# EAGLE design jiffy-neoram-smd (EAGLE 7.0.0)
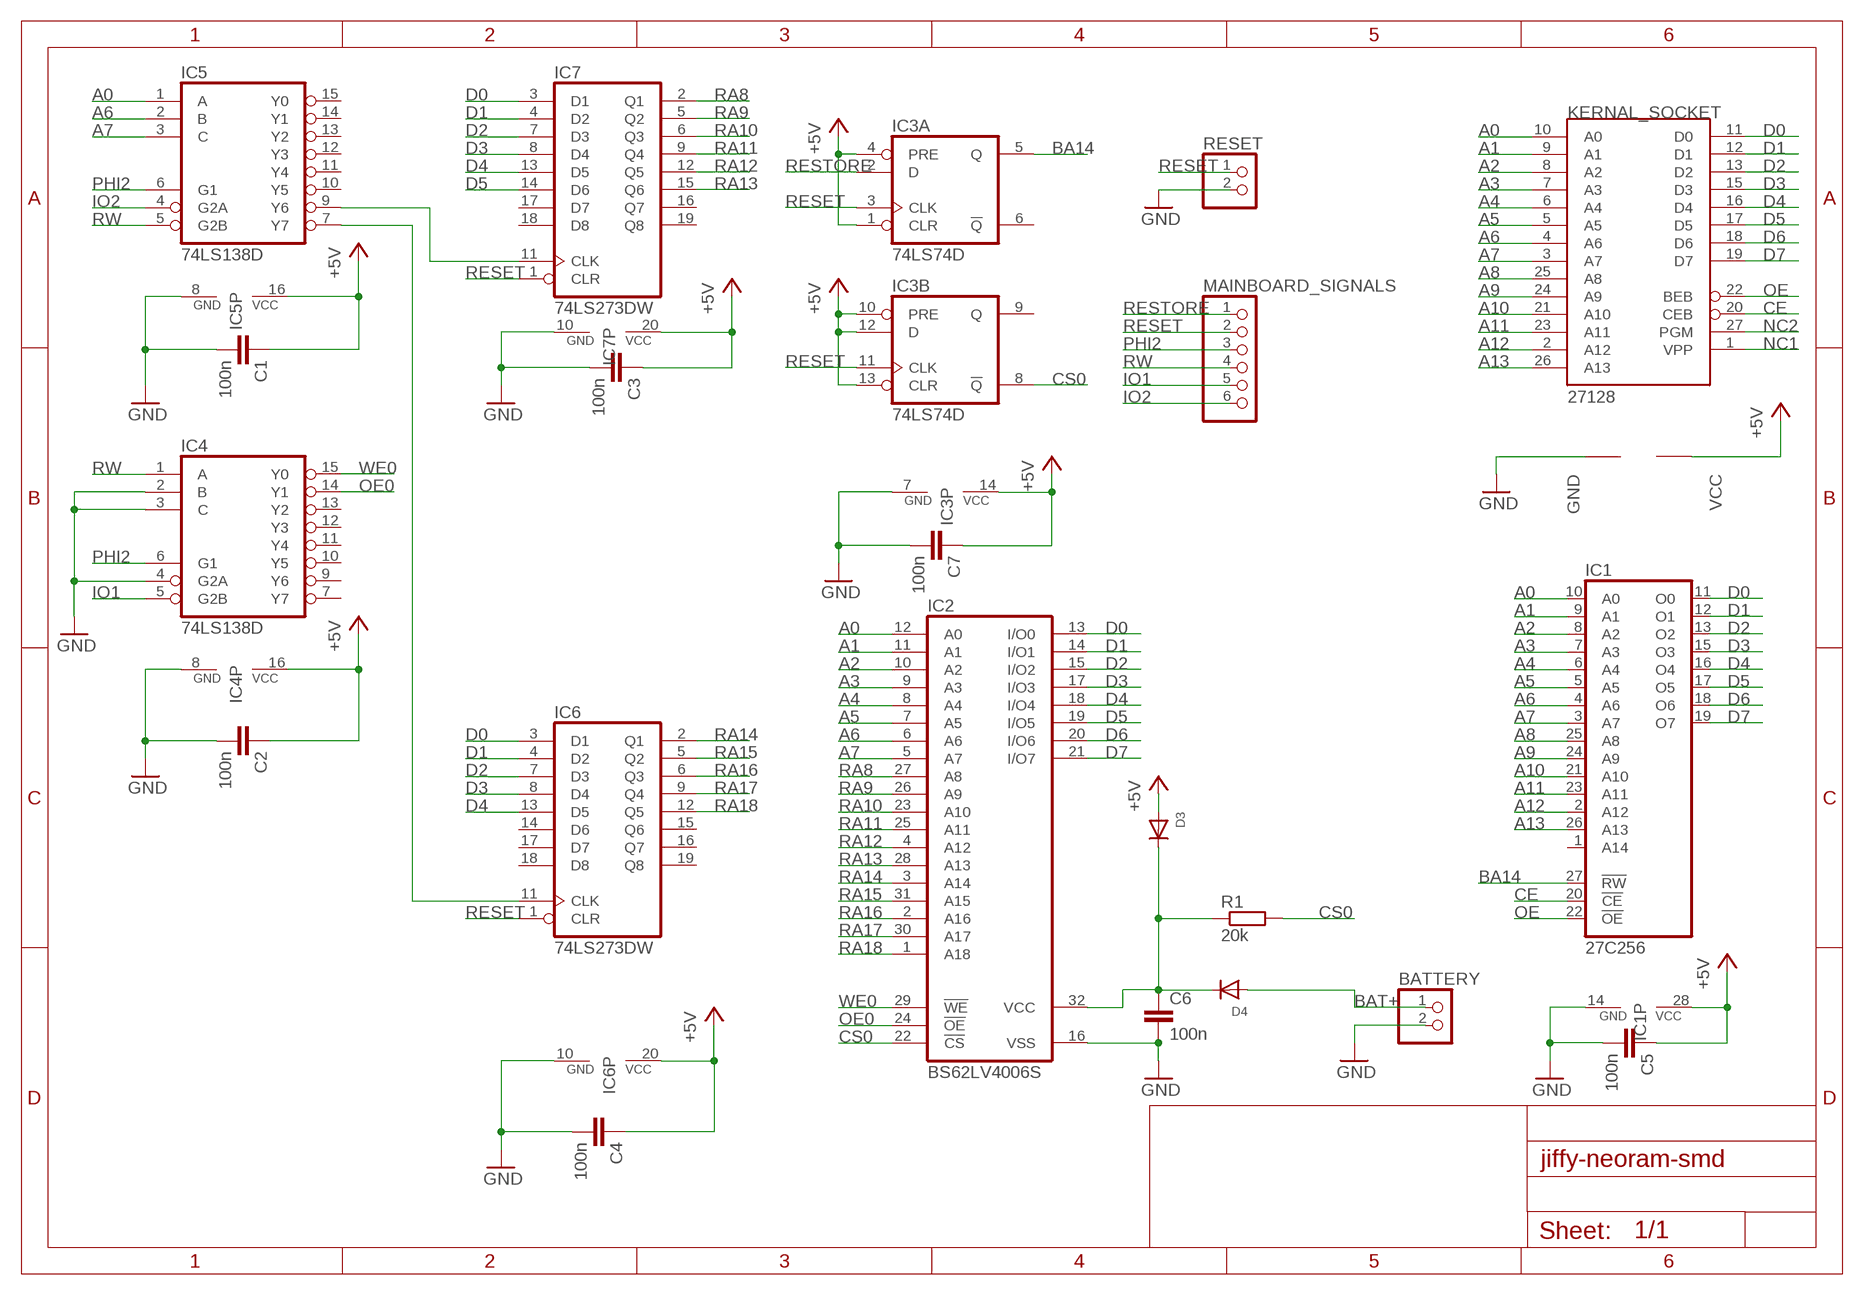
[diagram p0: schematic, sheet 1]

## Parts
BATTERY  HEADER-1X2ROUND  [1X02_ROUND]
C1  100n  C-EUC0603  [C0603]
C2  100n  C-EUC0603  [C0603]
C3  100n  C-EUC0603  [C0603]
C4  100n  C-EUC0603  [C0603]
C5  100n  C-EUC0603  [C0603]
C6  100n  C-EUC0603  [C0603]
C7  100n  C-EUC0603  [C0603]
D3  DIODESOD-323F  [SOD-323F]
D4  DIODESOD-323F  [SOD-323F]
IC1  27C256  TC55257DP  [DIL28]
IC2  BS62LV4006S  [SOP-32]
IC3  74LS74D  [SO14]
IC4  74LS138D  [SO16]
IC5  74LS138D  [SO16]
IC6  74LS273DW  [SO20W]
IC7  74LS273DW  [SO20W]
KERNAL_SOCKET  OSROM  [DIL28-6]
MAINBOARD_SIGNALS  HEADER-1X6ROUND  [1X06_ROUND]
R1  20k  R-EU_R0603  [R0603]
RESET  HEADER-1X2ROUND  [1X02_ROUND]

## Nets
+5V: C1.1 C2.1 C3.1 C4.1 C5.1 C7.1 D3.A IC1.28(VCC) IC3.1(A:CLR) IC3.4(A:PRE) IC3.10(B:PRE) IC3.12(B:D) IC3.13(B:CLR) IC3.14(P:VCC) IC4.16(VCC) IC5.16(VCC) IC6.20(VCC) IC7.20(VCC) KERNAL_SOCKET.28(VCC)
A0: IC1.10(A0) IC2.12(A0) IC5.1(A) KERNAL_SOCKET.10(A0)
A1: IC1.9(A1) IC2.11(A1) KERNAL_SOCKET.9(A1)
A2: IC1.8(A2) IC2.10(A2) KERNAL_SOCKET.8(A2)
A3: IC1.7(A3) IC2.9(A3) KERNAL_SOCKET.7(A3)
A4: IC1.6(A4) IC2.8(A4) KERNAL_SOCKET.6(A4)
A5: IC1.5(A5) IC2.7(A5) KERNAL_SOCKET.5(A5)
A6: IC1.4(A6) IC2.6(A6) IC5.2(B) KERNAL_SOCKET.4(A6)
A7: IC1.3(A7) IC2.5(A7) IC5.3(C) KERNAL_SOCKET.3(A7)
A8: IC1.25(A8) KERNAL_SOCKET.25(A8)
A9: IC1.24(A9) KERNAL_SOCKET.24(A9)
A10: IC1.21(A10) KERNAL_SOCKET.21(A10)
A11: IC1.23(A11) KERNAL_SOCKET.23(A11)
A12: IC1.2(A12) KERNAL_SOCKET.2(A12)
A13: IC1.26(A13) KERNAL_SOCKET.26(A13)
BA14: IC1.27(!RW) IC3.5(A:Q)
BAT+: BATTERY.1 D4.A
CE: IC1.20(!CE) KERNAL_SOCKET.20(CEB)
CS0: IC2.22(!CS) IC3.8(B:!Q) R1.2
D0: IC1.11(O0) IC2.13(I/O0) IC6.3(D1) IC7.3(D1) KERNAL_SOCKET.11(D0)
D1: IC1.12(O1) IC2.14(I/O1) IC6.4(D2) IC7.4(D2) KERNAL_SOCKET.12(D1)
D2: IC1.13(O2) IC2.15(I/O2) IC6.7(D3) IC7.7(D3) KERNAL_SOCKET.13(D2)
D3: IC1.15(O3) IC2.17(I/O3) IC6.8(D4) IC7.8(D4) KERNAL_SOCKET.15(D3)
D4: IC1.16(O4) IC2.18(I/O4) IC6.13(D5) IC7.13(D5) KERNAL_SOCKET.16(D4)
D5: IC1.17(O5) IC2.19(I/O5) IC7.14(D6) KERNAL_SOCKET.17(D5)
D6: IC1.18(O6) IC2.20(I/O6) KERNAL_SOCKET.18(D6)
D7: IC1.19(O7) IC2.21(I/O7) KERNAL_SOCKET.19(D7)
GND: BATTERY.2 C1.2 C2.2 C3.2 C4.2 C5.2 C6.2 C7.2 IC1.14(GND) IC2.16(VSS) IC3.7(P:GND) IC4.2(B) IC4.3(C) IC4.4(G2A) IC4.8(GND) IC5.8(GND) IC6.10(GND) IC7.10(GND) KERNAL_SOCKET.14(GND) RESET.2
IO1: IC4.5(G2B) MAINBOARD_SIGNALS.5
IO2: IC5.4(G2A) MAINBOARD_SIGNALS.6
N$1: IC5.9(Y6) IC7.11(CLK)
N$2: IC5.7(Y7) IC6.11(CLK)
N$3: C6.1 D3.C D4.C IC2.32(VCC) R1.1
NC1: KERNAL_SOCKET.1(VPP)
NC2: KERNAL_SOCKET.27(PGM)
OE: IC1.22(!OE) KERNAL_SOCKET.22(BEB)
OE0: IC2.24(!OE) IC4.14(Y1)
PHI2: IC4.6(G1) IC5.6(G1) MAINBOARD_SIGNALS.3
RA8: IC2.27(A8) IC7.2(Q1)
RA9: IC2.26(A9) IC7.5(Q2)
RA10: IC2.23(A10) IC7.6(Q3)
RA11: IC2.25(A11) IC7.9(Q4)
RA12: IC2.4(A12) IC7.12(Q5)
RA13: IC2.28(A13) IC7.15(Q6)
RA14: IC2.3(A14) IC6.2(Q1)
RA15: IC2.31(A15) IC6.5(Q2)
RA16: IC2.2(A16) IC6.6(Q3)
RA17: IC2.30(A17) IC6.9(Q4)
RA18: IC2.1(A18) IC6.12(Q5)
RESET: IC3.3(A:CLK) IC3.11(B:CLK) IC6.1(CLR) IC7.1(CLR) MAINBOARD_SIGNALS.2 RESET.1
RESTORE: IC3.2(A:D) MAINBOARD_SIGNALS.1
RW: IC4.1(A) IC5.5(G2B) MAINBOARD_SIGNALS.4
WE0: IC2.29(!WE) IC4.15(Y0)
Unconnected: IC1.1(A14) IC3.6(A:!Q) IC3.9(B:Q) IC4.7(Y7) IC4.9(Y6) IC4.10(Y5) IC4.11(Y4) IC4.12(Y3) IC4.13(Y2) IC5.10(Y5) IC5.11(Y4) IC5.12(Y3) IC5.13(Y2) IC5.14(Y1) IC5.15(Y0) IC6.14(D6) IC6.15(Q6) IC6.16(Q7) IC6.17(D7) IC6.18(D8) IC6.19(Q8) IC7.16(Q7) IC7.17(D7) IC7.18(D8) IC7.19(Q8)

## Library data of the parts
BATTERY RESET = microbuilder:HEADER-1X2: PIN HEADER
C1-C7 = resistor:C-EU: CAPACITOR, European symbol
D3 D4 = adafruit:DIODE: Diode SMADIODE - SMA Surface Mount Package 20V 1A Schottky Diode Digikey: 641-1014-6-ND DO-1N4148 - Through Hole Small Current Diode SOD-123 20V 1 A (.5mV Vf) Schottky Diode - Digikey: MBRX120TPMSCT-ND SOD-323 10V 570mA (.38mV Vf, 3ns) Schottky Diode - Digikey: ZLLS410CT-ND SOD-523 30V 30mA Schottky Diode (RB751S-40TE61) - Digikey: RB751S-40TE61CT-ND SOT23-R/W - SOT23 Package (R = Solder Paste/Reflow Ovens, W = Hand-Soldering) BAT54Film 40V 300mA - Digikey: 497-7162-1-ND
IC1 = memory:TC55257DP: MEMORY
IC2 = memory-bsi:BS62LV4006
IC3 = 74xx-eu:74*74: Dual D type positive edge triggered FLIP FLOP, preset and clear
IC4 IC5 = 74xx-eu:74*138: 3-line to 8-line DECODER/DEMULTIPLEXER
IC6 IC7 = 74xx-eu:74*273: Octal D type FLIP FLOP, clear
KERNAL_SOCKET = atari-chips-mod:OSROM
MAINBOARD_SIGNALS = microbuilder:HEADER-1X6: PIN HEADER
R1 = resistor:R-EU_: RESISTOR, European symbol

## Board
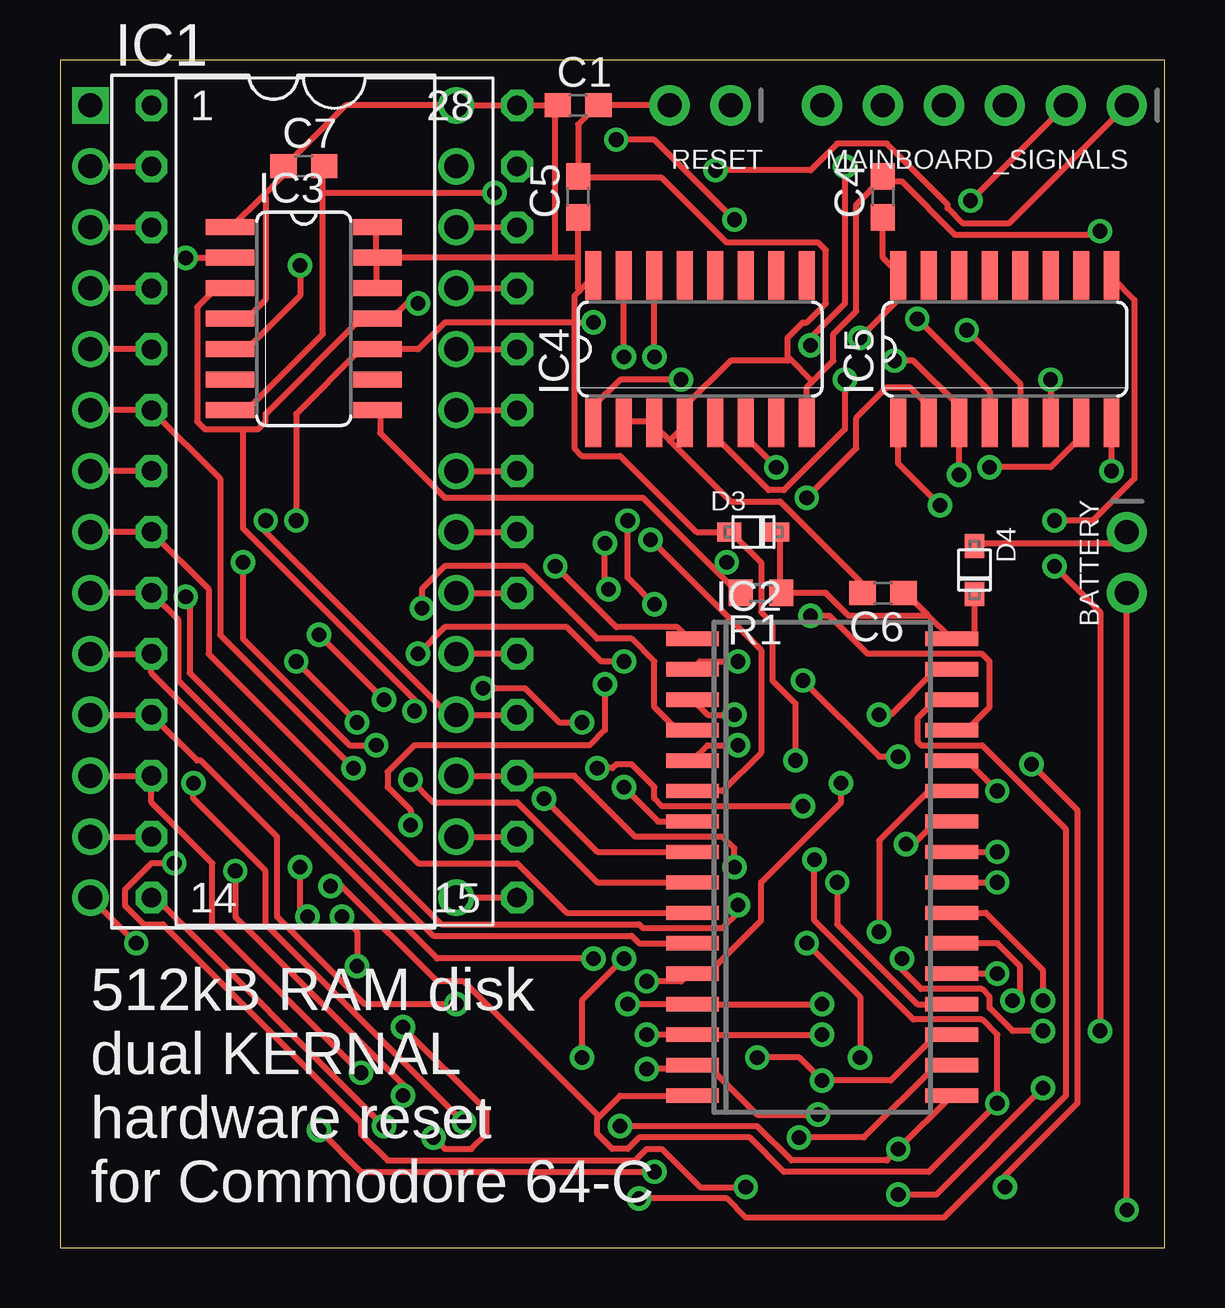
[diagram p1: board, top side]
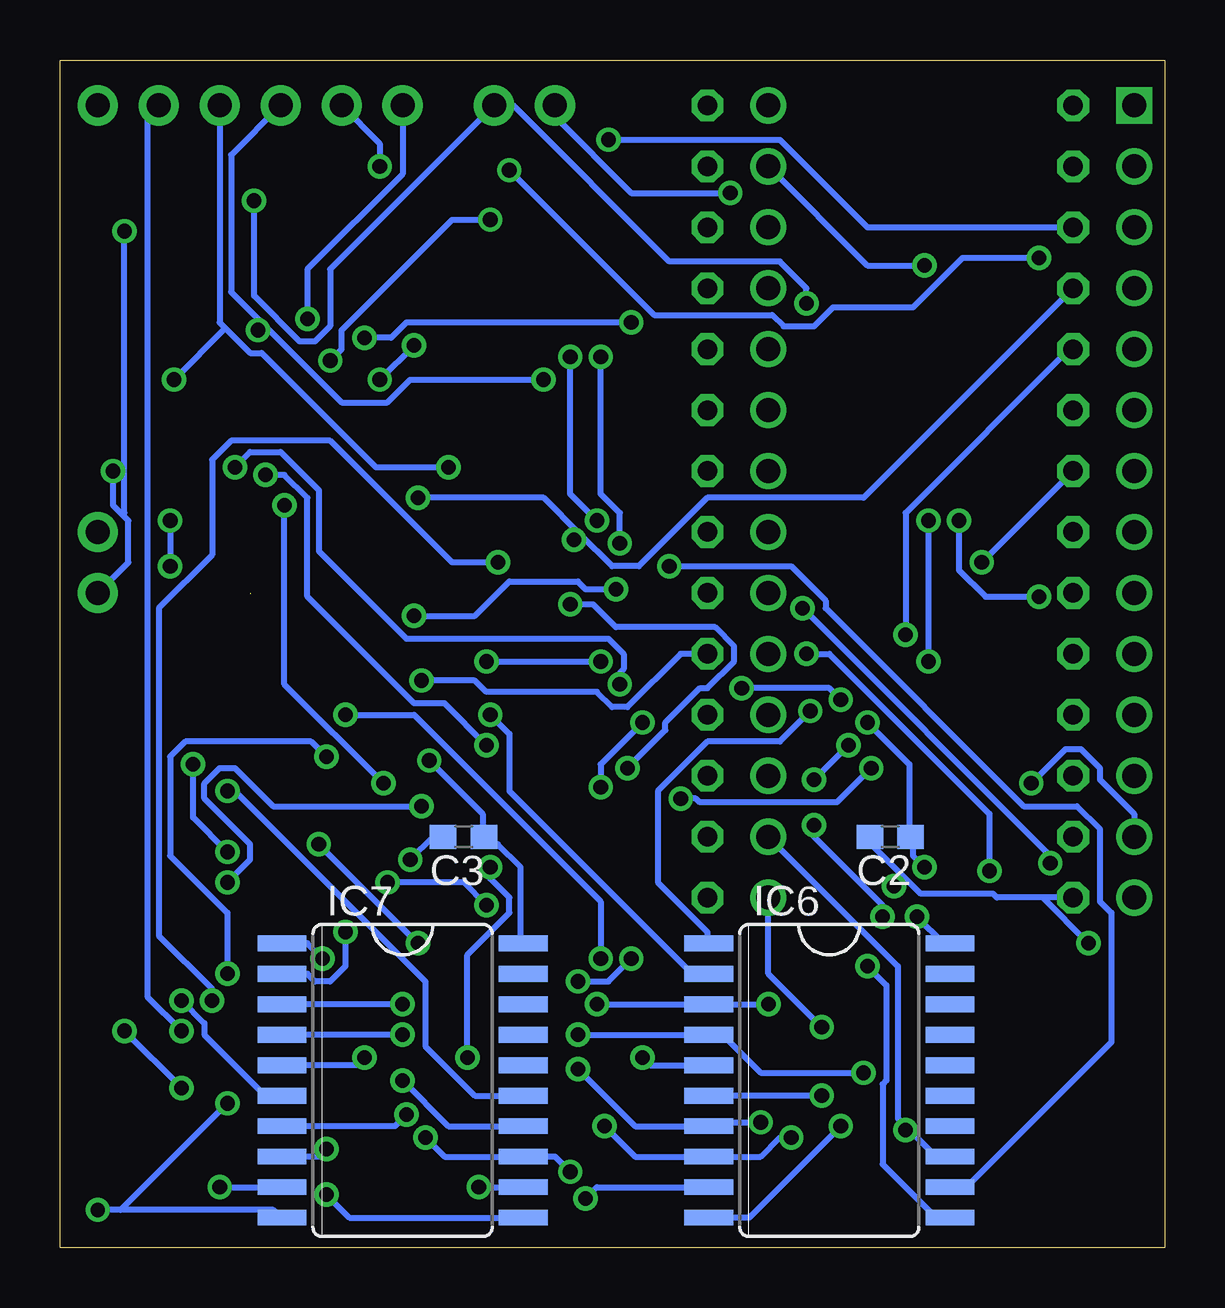
[diagram p2: board, bottom side, seen from below]

Size 46.02 x 49.52 mm. Coordinates in mm from the lower left corner, seen from the top.
Outline: 0,0 46.02,0 46.02,49.52 0,49.52 0,0
Copper layers (1*16): Top 0.035mm / dielectric 1.5mm / Bottom 0.035mm
Design rules "default": minimum track width 10mil, minimum drill 24mil, track to track 8mil, track to pad 8mil, pad to pad 8mil, via to via 8mil, smd to smd 8mil, copper to edge 40mil, drill to drill 8mil, minimum pad ring 10mil, minimum via ring 8mil, stop-mask expansion 4mil, vias tented up to drill 0mil, thermal gap 10mil

### Footprints (pad centres in the part's own frame; a part is rotated, then mirrored left to right if it is on the bottom)
1X02_ROUND = drill 1 pad 1.676: 1 -1.27,0; 2 1.27,0
C0603 = smd 1.1 x 1: 1 -0.85,0; 2 0.85,0
SOD-323F = smd 1 x 0.8: A -1,0; C 1,0
DIL28 = drill 1 square: 1 -16.51,-7.62 | drill 1: 2 -13.97,-7.62; 3 -11.43,-7.62; 4 -8.89,-7.62; 5 -6.35,-7.62; 6 -3.81,-7.62; 7 -1.27,-7.62; 8 1.27,-7.62; 9 3.81,-7.62; 10 6.35,-7.62; 11 8.89,-7.62; 12 11.43,-7.62; 13 13.97,-7.62; 14 16.51,-7.62; 15 16.51,7.62; 16 13.97,7.62; 17 11.43,7.62; 18 8.89,7.62; 19 6.35,7.62; 20 3.81,7.62; 21 1.27,7.62; 22 -1.27,7.62; 23 -3.81,7.62; 24 -6.35,7.62; 25 -8.89,7.62; 26 -11.43,7.62; 27 -13.97,7.62; 28 -16.51,7.62
SOP-32 = smd 0.6 x 2.2: 1 -9.525,-5.4; 2 -8.255,-5.4; 3 -6.985,-5.4; 4 -5.715,-5.4; 5 -4.445,-5.4; 6 -3.175,-5.4; 7 -1.905,-5.4; 8 -0.635,-5.4; 9 0.635,-5.4; 10 1.905,-5.4; 11 3.175,-5.4; 12 4.445,-5.4; 13 5.715,-5.4; 14 6.985,-5.4; 15 8.255,-5.4; 16 9.525,-5.4; 17 9.525,5.4; 18 8.255,5.4; 19 6.985,5.4; 20 5.715,5.4; 21 4.445,5.4; 22 3.175,5.4; 23 1.905,5.4; 24 0.635,5.4; 25 -0.635,5.4; 26 -1.905,5.4; 27 -3.175,5.4; 28 -4.445,5.4; 29 -5.715,5.4; 30 -6.985,5.4; 31 -8.255,5.4; 32 -9.525,5.4
SO14 = smd 0.66 x 2.032: 1 -3.81,-3.073; 2 -2.54,-3.073; 3 -1.27,-3.073; 4 0,-3.073; 5 1.27,-3.073; 6 2.54,-3.073; 7 3.81,-3.073; 8 3.81,3.073; 9 2.54,3.073; 10 1.27,3.073; 11 0,3.073; 12 -1.27,3.073; 13 -2.54,3.073; 14 -3.81,3.073
SO16 = smd 0.66 x 2.032: 1 -4.445,-3.073; 2 -3.175,-3.073; 3 -1.905,-3.073; 4 -0.635,-3.073; 5 0.635,-3.073; 6 1.905,-3.073; 7 3.175,-3.073; 8 4.445,-3.073; 9 4.445,3.073; 10 3.175,3.073; 11 1.905,3.073; 12 0.635,3.073; 13 -0.635,3.073; 14 -1.905,3.073; 15 -3.175,3.073; 16 -4.445,3.073
SO20W = smd 0.66 x 2.032: 1 -5.715,-5.029; 2 -4.445,-5.029; 3 -3.175,-5.029; 4 -1.905,-5.029; 5 -0.635,-5.029; 6 0.635,-5.029; 7 1.905,-5.029; 8 3.175,-5.029; 9 4.445,-5.029; 10 5.715,-5.029; 11 5.715,5.029; 12 4.445,5.029; 13 3.175,5.029; 14 1.905,5.029; 15 0.635,5.029; 16 -0.635,5.029; 17 -1.905,5.029; 18 -3.175,5.029; 19 -4.445,5.029; 20 -5.715,5.029
DIL28-6 = drill 0.813 octagon: 1 -16.51,-7.62; 2 -13.97,-7.62; 3 -11.43,-7.62; 4 -8.89,-7.62; 5 -6.35,-7.62; 6 -3.81,-7.62; 7 -1.27,-7.62; 8 1.27,-7.62; 9 3.81,-7.62; 10 6.35,-7.62; 11 8.89,-7.62; 12 11.43,-7.62; 13 13.97,-7.62; 14 16.51,-7.62; 15 16.51,7.62; 16 13.97,7.62; 17 11.43,7.62; 18 8.89,7.62; 19 6.35,7.62; 20 3.81,7.62; 21 1.27,7.62; 22 -1.27,7.62; 23 -3.81,7.62; 24 -6.35,7.62; 25 -8.89,7.62; 26 -11.43,7.62; 27 -13.97,7.62; 28 -16.51,7.62
1X06_ROUND = drill 1 pad 1.676: 1 -6.35,0; 2 -3.81,0; 3 -1.27,0; 4 1.27,0; 5 3.81,0; 6 6.35,0
R0603 = smd 1 x 1.1: 1 -0.85,0; 2 0.85,0

### Placement (x,y rotation side)
BATTERY  44.45,28.57 270 top
C1  21.59,47.62 0 top
C2  11.43,17.14 180 bottom
C3  29.21,17.14 180 bottom
C4  34.29,43.82 90 top
C5  21.59,43.82 90 top
C6  34.29,27.3 180 top
C7  10.16,45.09 0 top
D3  28.89,29.84 0 top
D4  38.1,28.26 270 top
IC1  8.89,31.12 270 top
IC2  31.75,15.88 270 top
IC3  10.16,38.73 270 top
IC4  26.67,37.46 0 top
IC5  39.37,37.46 0 top
IC6  13.97,6.98 270 bottom
IC7  31.75,6.98 270 bottom
KERNAL_SOCKET  11.43,31.12 270 top
MAINBOARD_SIGNALS  38.1,47.62 180 top
R1  29.21,27.3 180 top
RESET  26.67,47.62 180 top

### Tracks (layer width: path | path; a pad name or v marks a point on that pad's centre or on a via)
+5V  (via drill 0.61)
  Top 0.254: 8.49,43.89 7.14,42.54 IC3.1 | 8.49,43.89 9.21,44.61 9.21,45.09 C7.1 9.37,45.09 11.91,47.62 IC1.28 KERNAL_SOCKET.28 20.64,47.62 | IC3.4 7.78,38.73 8.57,39.53 8.57,43.82 8.49,43.89 | v10,15.88 10,14.13 v10.32,13.81 | 13.18,41.27 13.18,40.01 IC3.12 | 13.18,41.27 13.18,42.54 IC3.14 | 13.18,41.27 IC3.13 20.64,41.27 | C4.1 34.29,41.27 34.92,40.64 IC5.16 34.92,39.53 v33.34,37.94 | 21.43,38.58 21.43,39.69 21.67,39.93 | 21.43,38.58 21.43,33.34 21.75,33.02 23.34,33.02 26.51,29.84 D3.A 27.94,29.84 29.21,28.57 29.21,26.51 29.69,26.03 29.69,23.65 30.64,22.7 v30.64,20.32 | 21.67,39.93 22.23,40.48 IC4.16 | 21.59,41.27 21.59,40.01 21.67,39.93 | 21.59,41.27 C5.1 | 21.43,38.58 16.03,38.58 14.92,37.46 IC3.10 12.54,37.46 9.84,34.77 v9.84,30.32 | 21.43,38.58 v22.23,38.58 | 21.59,41.27 20.64,41.27 | v9.84,24.45 v12.38,21.91 | 20.64,41.27 20.64,47.62 | 20.64,47.62 C1.1
  Bottom 0.254: IC7.20 26.83,12.7 26.83,15.88 27.78,16.83 27.94,16.83 28.26,17.14 C3.1 28.42,17.14 28.42,18.1 v30.64,20.32 | v10,15.88 10.48,16.35 10.48,17.14 C2.1 10.64,17.14 10.64,20.16 v12.38,21.91 | v10.32,13.81 9.21,12.7 IC6.20 | v33.34,37.94 32.23,37.94 31.59,38.58 v22.23,38.58 | v9.84,30.32 v9.84,24.45
A0  (via drill 0.61)
  Top 0.254: IC1.10 KERNAL_SOCKET.10 3.81,23.97 15.72,12.06 v22.23,12.06 | IC5.1 34.92,32.7 v36.67,30.96 | v32.54,19.37 32.54,18.57 29.21,15.24 29.21,13.65 26.99,11.43 IC2.12 26.19,11.43 25.88,11.11 v24.45,11.11
  Bottom 0.254: v36.67,30.96 36.67,23.49 v32.54,19.37 | v22.23,12.06 23.18,11.11 v24.45,11.11
A1
  Top 0.254: IC2.11 24.13,12.7 23.81,13.02 15.56,13.02 4.92,23.65 4.92,26.19 KERNAL_SOCKET.9 IC1.9
A2
  Top 0.254: IC2.10 21.11,13.97 19.05,16.03 14.92,16.03 6.19,24.77 6.19,27.46 KERNAL_SOCKET.8 IC1.8
A3  (via drill 0.61)
  Top 0.254: IC2.9 22.38,15.24 19.05,18.57 15.56,18.57 v14.61,19.53 | v13.18,20.95 12.06,20.95 7.62,25.4 v7.62,28.57 | KERNAL_SOCKET.7 IC1.7
  Bottom 0.254: v13.18,20.95 v14.61,19.53 | KERNAL_SOCKET.7 v7.62,28.57
A4  (via drill 0.61)
  Top 0.254: IC2.8 22.38,16.51 v20.16,18.73 | v12.22,20 6.67,25.56 6.67,32.07 KERNAL_SOCKET.6 IC1.6
  Bottom 0.254: v20.16,18.73 19.53,18.73 19.37,18.57 13.65,18.57 v12.22,20
A5  (via drill 0.61)
  Top 0.254: IC2.7 24.92,17.78 v23.5,19.21 | v21.75,21.91 20.8,21.91 19.37,23.34 v17.62,23.34 | v10.79,25.56 v13.49,22.86 | KERNAL_SOCKET.5 IC1.5
  Bottom 0.254: v23.5,19.21 23.5,20.16 v21.75,21.91 | v17.62,23.34 13.97,23.34 v13.49,22.86 | v10.79,25.56 10.79,30.64 3.97,37.46 KERNAL_SOCKET.5
A6  (via drill 0.61)
  Top 0.254: IC5.2 36.2,35.08 35.4,35.88 34.45,35.88 33.18,34.61 33.18,33.34 v31.11,31.27 | IC2.6 27.62,19.05 29.21,20.64 29.21,24.92 v24.61,29.53 | KERNAL_SOCKET.4 IC1.4
  Bottom 0.254: v31.11,31.27 25.88,31.27 24.37,29.77 | 24.37,29.77 23.02,28.42 21.91,28.42 19.05,31.27 12.54,31.27 KERNAL_SOCKET.4 | 24.37,29.77 v24.61,29.53
A7  (via drill 0.61)
  Top 0.254: IC1.3 KERNAL_SOCKET.3 | v37.47,32.23 IC5.3 37.47,35.08 35.56,36.99 v34.77,36.99 | v28.26,20.95 26.99,20.95 IC2.5 | v23.18,46.2 24.77,46.2 v28.1,42.86
  Bottom 0.254: v37.47,32.23 36.67,32.23 35.72,31.27 35.72,27.15 31.27,22.7 30,22.7 v28.26,20.95 | KERNAL_SOCKET.3 12.38,42.54 16.03,46.2 v23.18,46.2 | v28.1,42.86 29.69,42.86 34.29,38.26 34.29,37.46 v34.77,36.99
A8
  Top 0.254: IC1.25 KERNAL_SOCKET.25
A9
  Top 0.254: IC1.24 KERNAL_SOCKET.24
A10
  Top 0.254: IC1.21 KERNAL_SOCKET.21
A11
  Top 0.254: IC1.23 KERNAL_SOCKET.23
A12
  Top 0.254: IC1.2 KERNAL_SOCKET.2
A13
  Top 0.254: IC1.26 KERNAL_SOCKET.26
BA14  (via drill 0.61)
  Top 0.254: IC3.5 7.78,37.46 10,39.69 v10,40.96
  Bottom 0.254: v10,40.96 12.38,40.96 IC1.27
BAT+
  Top 0.254: BATTERY.1 43.97,29.37 38.1,29.37 D4.A
CE
  Top 0.254: IC1.20 KERNAL_SOCKET.20
CS0  (via drill 0.61)
  Top 0.254: 27.38,28.18 24.29,31.27 16.03,31.27 13.34,33.97 13.34,34.93 IC3.8 | 27.38,28.18 28.26,27.3 R1.2 | IC2.22 39.05,12.7 40.01,11.75 40.01,10.64 v39.69,10.32 | 27.38,28.18 v27.78,28.57
  Bottom 0.254: v39.69,10.32 39.69,10.8 41.91,13.02 41.91,26.67 39.69,28.89 39.69,32.86 38.89,33.66 34.77,33.66 29.69,28.57 v27.78,28.57
D0  (via drill 0.61)
  Top 0.254: IC1.11 KERNAL_SOCKET.11 5.71,20.32 5.87,20.32 9.05,17.14 9.05,13.81 12.7,10.16 v16.51,10.16 | v23.65,10.16 IC2.13 v31.75,10.16
  Bottom 0.254: v23.65,10.16 IC6.3 v16.51,10.16 | v31.75,10.16 IC7.3
D1  (via drill 0.61)
  Top 0.254: IC1.12 KERNAL_SOCKET.12 3.81,18.57 6.35,16.03 6.35,13.49 v12.54,7.3 | v24.45,8.89 IC2.14 v31.75,8.89
  Bottom 0.254: v24.45,8.89 IC6.4 18.41,8.89 16.83,7.3 v12.54,7.3 | v31.75,8.89 IC7.4
D2  (via drill 0.61)
  Top 0.254: IC1.13 KERNAL_SOCKET.13 | v24.45,7.46 26.04,7.46 26.19,7.62 IC2.15 26.99,7.62 29.05,5.56 v31.59,5.56 | v5.56,19.37 5.56,18.73 8.57,15.72 8.57,13.49 v16.83,5.24
  Bottom 0.254: v24.45,7.46 22.07,5.08 IC6.7 18.89,5.08 18.73,5.24 v16.83,5.24 | IC7.7 32.07,5.08 v31.59,5.56 | IC1.13 1.27,18.1 2.7,19.53 2.7,20 3.49,20.8 4.13,20.8 v5.56,19.37
D3  (via drill 0.61)
  Top 0.254: IC1.15 KERNAL_SOCKET.15 | v23.34,5.08 29.05,5.08 30.48,3.65 34.45,3.65 v34.92,4.13 IC2.17 | v14.29,9.21 17.78,5.71 17.78,4.76 17.14,4.13 16.03,4.13 v15.56,4.6
  Bottom 0.254: v23.34,5.08 22.07,3.81 IC6.8 16.83,3.81 16.03,4.6 v15.56,4.6 | IC7.8 35.24,3.81 v34.92,4.13 | IC1.15 16.51,11.43 v14.29,9.21
D4  (via drill 0.61)
  Top 0.254: v30.8,4.6 33.5,4.6 36.51,7.62 IC2.18 | IC1.16 KERNAL_SOCKET.16 | v24.77,3.17 12.54,3.17 v10.79,4.92
  Bottom 0.254: v30.8,4.6 30,3.81 IC7.13 25.4,3.81 v24.77,3.17 | IC6.13 9.53,3.81 10.72,5 | 10.72,5 11.11,5.4 11.11,11.75 IC1.16 | v10.79,4.92 10.72,5
D5  (via drill 0.61)
  Top 0.254: IC1.17 KERNAL_SOCKET.17 21.43,19.69 23.97,17.14 27.62,17.14 28.1,16.67 v28.1,15.88 | IC2.19 36.51,8.89 34.61,6.98 v31.75,6.98 30.8,7.94 v29.05,7.94
  Bottom 0.254: IC7.14 29.84,5.08 v31.75,6.98 | v28.1,15.88 28.1,15.4 27.3,14.6 27.3,13.97 29.05,12.22 v29.05,7.94
D6  (via drill 0.61)
  Top 0.254: IC2.20 35.72,10.16 32.38,13.49 v32.38,15.24 | v28.26,14.29 28.26,13.97 27.62,13.34 24.29,13.34 24.13,13.49 15.88,13.49 5.4,23.97 5.4,26.99 v5.24,27.15 | v8.57,30.32 8.57,29.84 16.19,22.23 IC1.18 KERNAL_SOCKET.18
  Bottom 0.254: v32.38,15.24 29.21,15.24 v28.26,14.29 | v5.24,27.15 7.46,27.15 8.57,28.26 v8.57,30.32
D7  (via drill 0.61)
  Top 0.254: v39.05,11.43 IC2.21 | v34.92,20.48 34.13,20.48 v30.96,23.65 | KERNAL_SOCKET.19 IC1.19
  Bottom 0.254: v39.05,11.43 39.05,13.97 41.43,16.35 41.43,20.48 40.8,21.11 35.56,21.11 v34.92,20.48 | v30.96,23.65 28.73,23.65 28.26,23.18 23.65,23.18 23.02,22.54 22.38,22.54 20.16,24.77 KERNAL_SOCKET.19
GND  (via drill 0.6, 0.61)
  Top 0.254: 25.4,33.66 24.77,34.29 IC4.3 24.77,34.45 23.5,34.45 IC4.2 | 25.4,33.66 27.94,31.12 30,31.12 33.34,27.78 33.34,27.3 C6.2 | 25.4,33.66 26.04,34.29 IC4.4 26.04,35.08 27.94,36.99 30.32,36.99 30.4,37.07 | 10.95,43.97 10.95,38.1 7.78,34.93 IC3.7 | 10.95,43.97 10.95,45.09 C7.2 | RESET.2 C1.2 22.38,47.62 21.59,46.83 C5.2 21.59,44.61 25.08,44.61 27.78,41.91 31.59,41.91 31.91,41.59 31.91,39.37 31.11,38.58 30.96,38.58 30.32,37.94 30.32,37.15 30.4,37.07 | 31.35,36.12 31.11,35.88 IC4.8 | 31.35,36.12 32.23,36.99 32.23,38.1 33.18,39.05 33.18,43.5 34.29,44.61 C4.2 34.29,44.45 35.08,44.45 37.31,42.23 43.18,42.23 v43.34,42.39 | 31.35,36.12 30.4,37.07 | v18.1,43.97 10.95,43.97 | v13.49,5.08 3.97,14.6 KERNAL_SOCKET.14 | v3.17,12.7 IC1.14 | v43.81,32.38 IC5.8 | v31.43,16.19 31.43,13.65 35.56,9.52 38.42,9.52 39.05,8.89 v39.05,6.03 36.2,3.17 30.16,3.17 28.73,4.6 24.13,4.6 23.65,4.13 23.02,4.13 22.38,4.76 22.38,5.4 22.46,5.48 | IC2.16 23.34,6.35 22.46,5.48 | v44.45,1.59 BATTERY.2 | v11.27,15.08 11.75,15.08 15.72,11.11 16.83,11.11 22.46,5.48
  Bottom 0.254: v18.1,43.97 22.23,43.97 25.4,47.15 RESET.2 | 10.87,15.48 10.16,14.76 7.14,14.76 6.99,14.6 5.08,14.6 | 10.87,15.48 12.22,16.83 12.22,17.14 C2.2 | KERNAL_SOCKET.14 5.08,14.6 | IC6.10 17.3,1.27 v13.49,5.08 | 5.08,14.6 v3.17,12.7 | v43.81,32.38 43.81,30.96 43.42,30.56 | 43.42,30.56 43.18,30.32 43.18,28.57 BATTERY.2 | 43.5,1.59 37.15,1.59 36.83,1.27 IC7.10 | 43.5,1.59 v44.45,1.59 | C3.2 30.48,17.14 v31.43,16.19 | 43.5,1.59 v39.05,6.03 | v11.27,15.08 10.87,15.48 | v43.34,42.39 43.34,30.64 43.42,30.56
IO1  (via drill 0.61)
  Top 0.254: IC4.5 27.3,33.81 29.53,31.59 30.16,31.59 32.7,34.13 v32.7,36.2 | v31.27,37.62 31.27,37.94 32.7,39.37 v32.7,45.09
  Bottom 0.254: v31.27,37.62 v32.7,36.2 | v32.7,45.09 32.7,46.04 MAINBOARD_SIGNALS.5
IO2  (via drill 0.61)
  Top 0.254: IC5.4 38.73,35.72 v35.72,38.73
  Bottom 0.254: v35.72,38.73 35.72,40.8 31.75,44.77 MAINBOARD_SIGNALS.6
N$1  (via drill 0.61)
  Top 0.254: v34.92,2.22 36.51,2.22 v40.96,6.67 | v43.34,9.05 43.34,26.51 v41.43,28.42 | v41.43,30.32 43.02,30.32 44.77,32.07 44.77,39.53 43.81,40.48 IC5.9
  Bottom 0.254: IC7.11 33.97,1.27 v34.92,2.22 | v43.34,9.05 v40.96,6.67 | v41.43,30.32 v41.43,28.42
N$2  (via drill 0.61)
  Top 0.254: v12.38,11.75 12.38,13.18 v11.75,13.81 | v14.61,17.62 14.61,18.26 13.65,19.21 13.65,19.84 14.76,20.95 22.07,20.95 22.7,21.59 v22.7,23.49 | v38.73,32.54 41.27,32.54 42.55,33.81 IC5.7
  Bottom 0.254: IC6.11 9.53,1.27 11.75,3.49 11.75,6.83 11.59,6.98 11.59,10.95 v12.38,11.75 | v11.75,13.81 11.75,14.29 14.61,17.14 v14.61,17.62 | v22.7,23.49 22.7,23.97 22.54,24.13 22.54,24.77 23.18,25.4 31.59,25.4 35.24,29.05 35.24,31.59 36.83,33.18 38.1,33.18 v38.73,32.54
N$3  (1 unrouted)
  Top 0.254: D3.C 30,29.84 30,27.3 R1.1 31.91,27.3 32.86,26.35 36.04,26.35 36.12,26.43 | 36.12,26.43 IC2.32 38.1,25.4 38.1,27.3 | 36.12,26.43 35.24,27.3 C6.1
OE
  Top 0.254: IC1.22 KERNAL_SOCKET.22
OE0  (via drill 0.61)
  Top 0.254: v24.77,37.15 IC4.14 | v23.65,30.32 23.65,27.94 v24.77,26.83 | v22.38,20 23.02,20 23.18,20.16 23.81,20.16 24.77,19.21 24.77,18.73 25.08,18.41 v30.96,18.41 | IC2.24 v39.05,15.24
  Bottom 0.254: v24.77,37.15 24.77,31.43 v23.65,30.32 | v24.77,26.83 23.81,26.83 22.86,25.88 18.73,25.88 17.94,25.08 17.94,24.45 19.05,23.34 19.37,23.34 20.8,21.91 20.8,21.59 v22.38,20 | v30.96,18.41 37.15,18.41 38.73,20 39.37,20 40.01,19.37 40.01,18.73 38.1,16.83 38.1,16.19 v39.05,15.24
PHI2  (via drill 0.61)
  Top 0.254: IC4.6 28.57,33.81 v29.84,32.54 | v41.27,36.2 IC5.6
  Bottom 0.254: v29.84,32.54 32.86,32.54 37.62,37.31 38.1,37.31 39.13,38.34 | 39.13,38.34 39.37,38.58 MAINBOARD_SIGNALS.3 | 39.13,38.34 v41.27,36.2
RA8  (via drill 0.61)
  Top 0.254: v34.13,13.18 34.13,16.99 36.2,19.05 IC2.27
  Bottom 0.254: IC7.2 35.72,11.43 35.4,11.11 34.77,11.11 34.13,11.75 v34.13,13.18
RA9  (via drill 0.61)
  Top 0.254: v33.34,7.94 33.34,10.48 v31.11,12.7 | v35.24,16.83 35.56,16.83 36.51,17.78 IC2.26
  Bottom 0.254: IC7.5 33.66,7.62 v33.34,7.94 | v35.24,16.83 v31.11,12.7
RA10  (via drill 0.61)
  Top 0.254: v40.96,10.32 40.96,11.59 38.58,13.97 IC2.23
  Bottom 0.254: IC7.6 37.47,6.35 40.01,8.89 40.01,9.37 v40.96,10.32
RA11  (via drill 0.61)
  Top 0.254: v39.37,2.54 39.37,3.02 42.39,6.03 42.39,18.26 v40.48,20.16 | IC2.25 v39.05,16.51
  Bottom 0.254: v39.37,2.54 IC7.9 | v40.48,20.16 40.48,17.94 v39.05,16.51
RA12  (via drill 0.61)
  Top 0.254: v28.57,2.54 26.67,2.54 25.08,4.13 24.45,4.13 23.97,3.65 13.65,3.65 12.54,4.76 12.54,5.24 4.29,13.49 3.49,13.49 2.7,14.29 2.7,14.92 3.81,16.03 v4.76,16.03 | v15.08,26.67 15.08,27.46 16.03,28.42 19.37,28.42 22.38,25.4 23.81,25.4 24.77,24.45 24.77,22.54 25.72,21.59 IC2.4
  Bottom 0.254: v28.57,2.54 IC7.12 | v4.76,16.03 4.76,16.35 v15.08,26.67
RA13  (via drill 0.61)
  Top 0.254: v39.05,19.05 37.78,20.32 IC2.28
  Bottom 0.254: IC7.15 28.73,6.35 30.8,8.41 30.8,11.11 38.73,19.05 v39.05,19.05
RA14  (via drill 0.61)
  Top 0.254: v28.1,22.23 26.99,22.23 IC2.3
  Bottom 0.254: IC6.2 19.68,11.43 27.3,19.05 27.3,21.43 v28.1,22.23
RA15  (via drill 0.61)
  Top 0.254: v21.75,7.94 21.75,10.32 v23.5,12.06 | v34.13,22.23 34.61,22.23 36.51,24.13 IC2.31
  Bottom 0.254: IC6.5 21.43,7.62 v21.75,7.94 | v23.5,12.06 23.5,14.45 31.27,22.23 v34.13,22.23
RA16  (via drill 0.61)
  Top 0.254: v14.29,6.35 14.29,6.83 7.3,13.81 v7.3,15.72 | v14.92,24.77 16.03,25.88 21.11,25.88 22.54,24.45 v23.5,24.45 | v28.26,24.45 26.67,24.45 IC2.2
  Bottom 0.254: v14.29,6.35 IC6.6 | v7.3,15.72 7.3,18.1 13.97,24.77 v14.92,24.77 | v28.26,24.45 v23.5,24.45
RA17  (via drill 0.61)
  Top 0.254: v24.13,2.06 27.78,2.06 28.57,1.27 36.83,1.27 41.91,6.35 41.91,17.46 38.42,20.95 35.88,20.95 35.72,21.11 35.72,22.07 36.51,22.86 IC2.30
  Bottom 0.254: IC6.9 23.65,2.54 v24.13,2.06
RA18  (via drill 0.61)
  Top 0.254: v20.64,28.42 23.18,25.88 25.72,25.88 26.19,25.4 IC2.1
  Bottom 0.254: IC6.12 8.26,2.54 2.22,8.57 2.22,13.97 2.7,14.45 2.7,17.46 3.65,18.41 5.87,18.41 14.13,26.67 14.13,26.99 15.56,28.42 v20.64,28.42
RESET  (via drill 0.61)
  Top 0.254: v35.08,12.06 35.08,11.59 35.88,10.8 38.42,10.8 38.73,10.48 38.73,10 39.69,9.05 v40.96,9.05 | 7.62,34.13 6.03,34.13 5.71,34.45 5.71,39.21 6.51,40.01 IC3.3 | 7.62,34.13 8.26,34.13 8.57,34.45 8.57,34.77 12.54,38.73 IC3.11 13.81,38.73 14.45,39.37 v14.92,39.37 | v14.76,22.38 14.76,22.86 7.62,30 7.62,34.13 | v37.94,43.66 MAINBOARD_SIGNALS.2
  Bottom 0.254: IC7.1 35.72,12.7 v35.08,12.06 | v40.96,9.05 42.39,10.48 42.39,47.15 MAINBOARD_SIGNALS.2 | v14.76,22.38 16.03,21.11 19.05,21.11 21.11,19.05 21.11,15.24 19.05,13.18 19.05,12.7 IC6.1 | v14.92,39.37 14.92,40.01 16.03,41.12 20.64,41.12 27.15,47.62 RESET.1 34.77,40.8 34.77,38.42 35.4,37.78 36.04,37.78 37.94,39.69 v37.94,43.66
RESTORE  (via drill 0.61)
  Top 0.254: v5.24,41.27 IC3.2 | v27.3,44.93 31.27,44.93 32.38,46.04 34.45,46.04 36.99,43.5 36.99,43.34 37.62,42.7 39.53,42.7 MAINBOARD_SIGNALS.1
  Bottom 0.254: v5.24,41.27 8.41,41.27 10.48,39.21 13.81,39.21 14.61,38.42 15.88,38.42 16.35,38.89 21.27,38.89 v27.3,44.93
RW  (via drill 0.61)
  Top 0.254: IC4.1 22.23,35.08 23.34,36.2 v25.88,36.2 | IC5.5 40.01,36.04 v37.78,38.26
  Bottom 0.254: v25.88,36.2 31.43,36.2 32.38,35.24 34.29,35.24 37.54,38.5 | 37.54,38.5 38.89,39.85 38.89,45.56 MAINBOARD_SIGNALS.4 | 37.54,38.5 v37.78,38.26
WE0  (via drill 0.61)
  Top 0.254: v23.5,37.15 IC4.15 | v22.7,29.37 22.7,27.62 v22.86,27.46 | v31.27,26.35 32.07,26.35 33.66,24.77 38.42,24.77 38.73,24.45 38.73,22.54 37.78,21.59 IC2.29
  Bottom 0.254: v23.5,37.15 23.5,31.43 22.7,30.64 v22.7,29.37 | v22.86,27.46 24.13,27.46 24.45,27.78 27.3,27.78 28.73,26.35 v31.27,26.35

### Text on the board
tNames: 512kB RAM disk / dual KERNAL / hardware reset / for Commodore 64-C